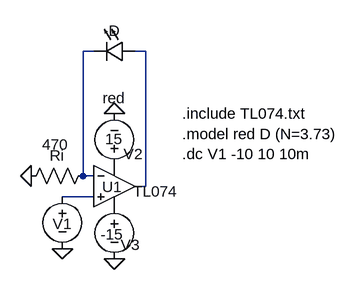
[diagram p0: schematic 4.3.1.circuit.asc]
4.3.1.circuit.asc, the LTspice schematic file:
Version 4
SHEET 1 880 680
WIRE 288 80 272 80
WIRE 368 80 352 80
WIRE 272 272 272 80
WIRE 288 272 272 272
WIRE 368 288 368 80
WIRE 368 288 352 288
WIRE 288 304 240 304
FLAG 192 272 0
FLAG 240 384 0
FLAG 320 400 0
FLAG 320 176 0
SYMBOL Res 288 256 R90
WINDOW 3 -48 59 VTop 2
WINDOW 0 0 56 VBottom 2
SYMATTR Value 470
SYMATTR InstName Ri
SYMBOL opamp2 320 224 R0
WINDOW 0 -19 65 Left 2
WINDOW 3 29 72 Left 2
SYMATTR InstName U1
SYMATTR Value TL074
SYMBOL LED 352 64 R90
WINDOW 0 0 32 VBottom 2
WINDOW 3 72 32 VTop 2
SYMATTR InstName D
SYMATTR Value red
SYMBOL Voltage 240 288 R0
WINDOW 0 -15 58 Left 2
WINDOW 3 19 139 Left 2
SYMATTR InstName V1
SYMATTR Value ""
SYMBOL Voltage 320 272 R180
WINDOW 0 -44 34 Left 2
WINDOW 3 -13 57 Left 2
SYMATTR InstName V2
SYMATTR Value 15
SYMBOL Voltage 320 304 R0
WINDOW 0 10 74 Left 2
WINDOW 3 -21 58 Left 2
SYMATTR InstName V3
SYMATTR Value -15
TEXT 424 176 Left 2 !.include TL074.txt\n.model red D (N=3.73)\n.dc V1 -10 10 10m

The netlist it stands for:
* 4.3.1.circuit.asc
Ri N001 0 470
XU1 N003 N001 P001 P002 N002 TL074  ; pins In+ In- V+ V- OUT
D N002 N001 red
V1 N003 0
V2 P001 0 15
V3 P002 0 -15
.model D D
.lib standard.dio
.include TL074.txt
.model red D (N=3.73)
.dc V1 -10 10 10m
.backanno
.end